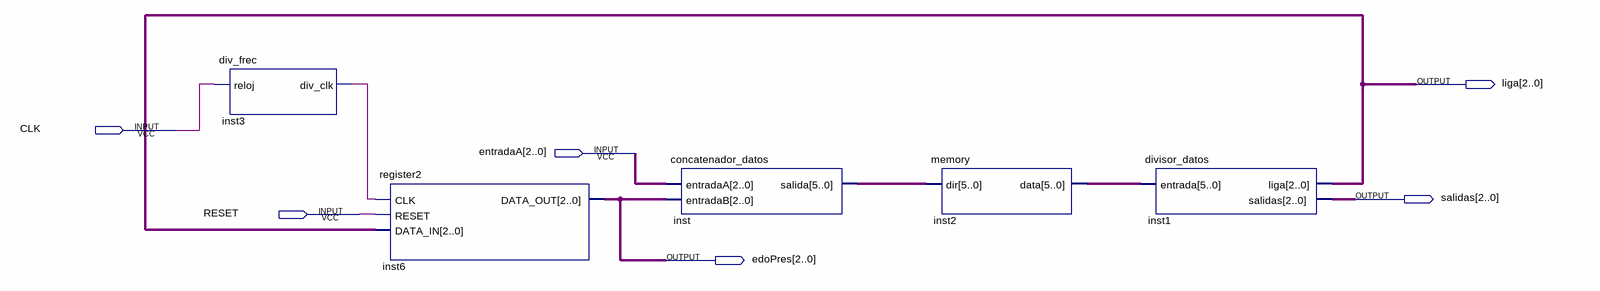
[diagram p0: schematic sheet]
// Quartus schematic P3_OAC.bdf as structural Verilog: 5 symbols, 6 pins
module P3_OAC (
  input  CLK,
  input  [2:0] entradaA,
  input  RESET,
  output [2:0] liga,
  output [2:0] salidas,
  output [2:0] edoPres
);

  wire inst3_div_clk;
  wire [5:0] inst2_data, inst_salida;

  div_frec inst3 (.reloj(CLK), .div_clk(inst3_div_clk));
  register2 inst6 (.CLK(inst3_div_clk), .RESET(RESET), .DATA_IN(liga), .DATA_OUT(edoPres));
  concatenador_datos inst (.entradaA(entradaA), .entradaB(edoPres), .salida(inst_salida));
  memory inst2 (.dir(inst_salida), .data(inst2_data));
  divisor_datos inst1 (.entrada(inst2_data), .liga(liga), .salidas(salidas));
endmodule
